# EasyEDA Pro project ProPrj_DiscoTech 6 Current_2026-05-06.epro, board Input_No_Phono
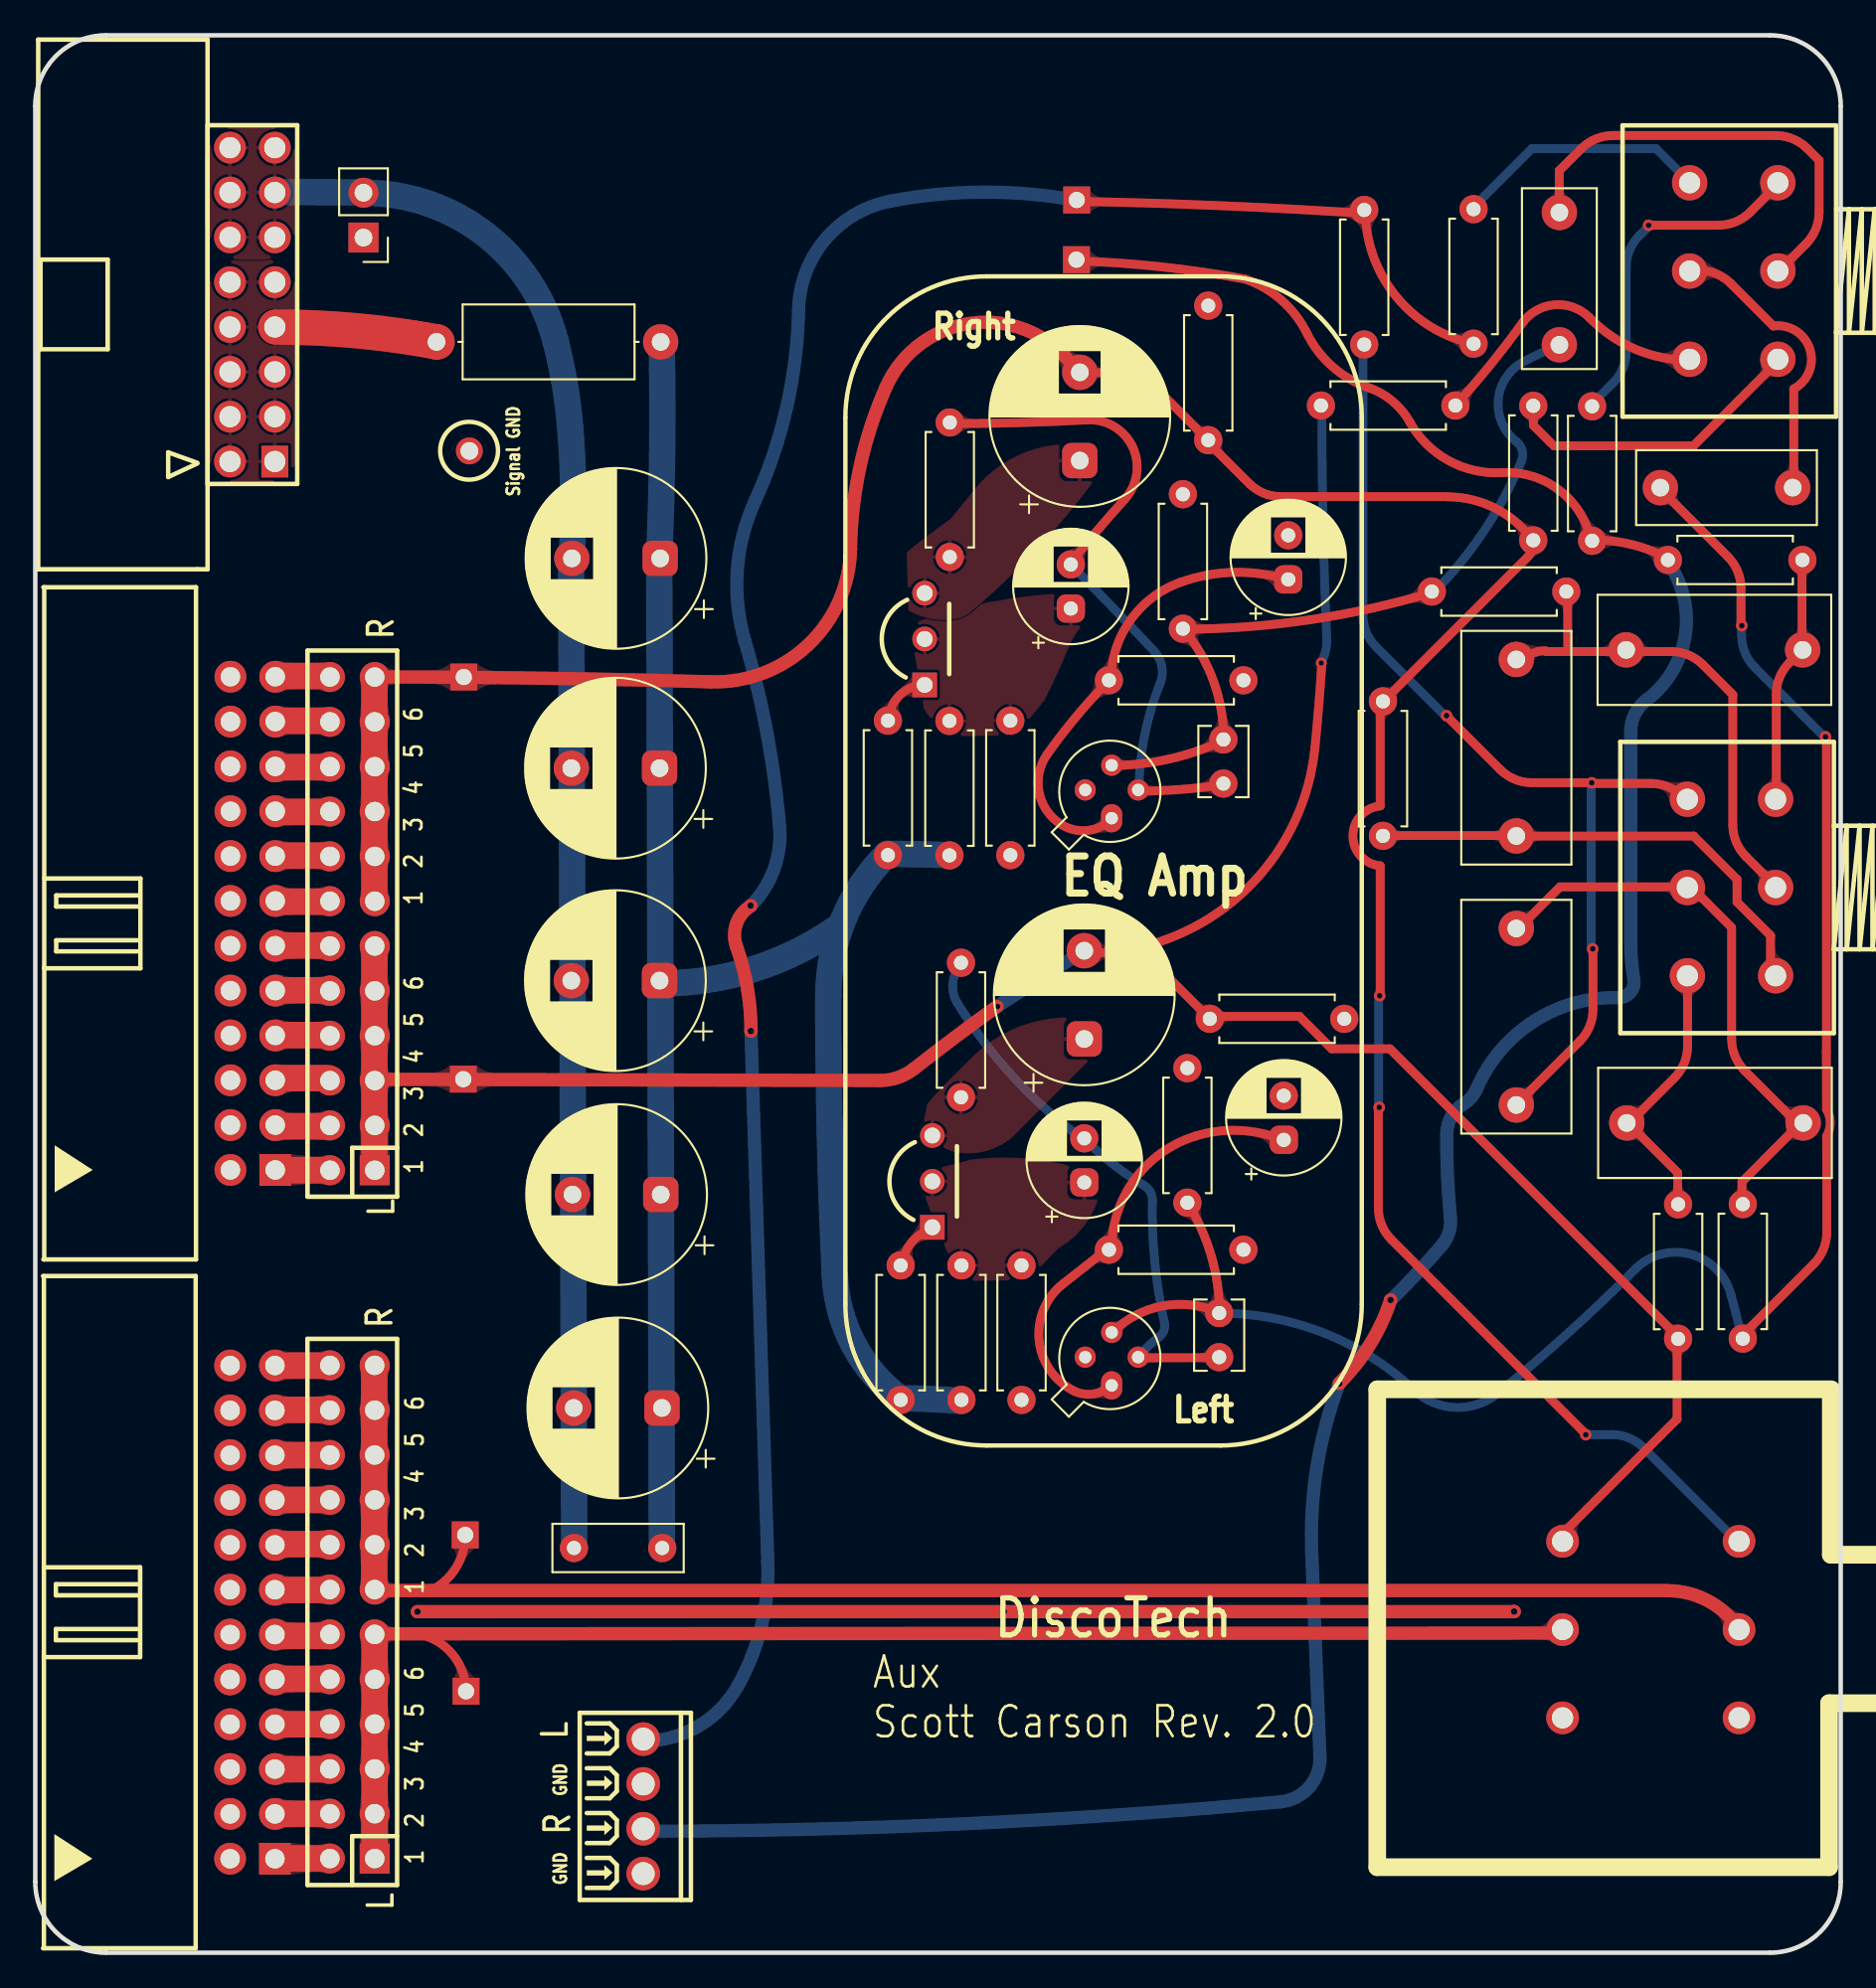
[diagram p22: board, top side]
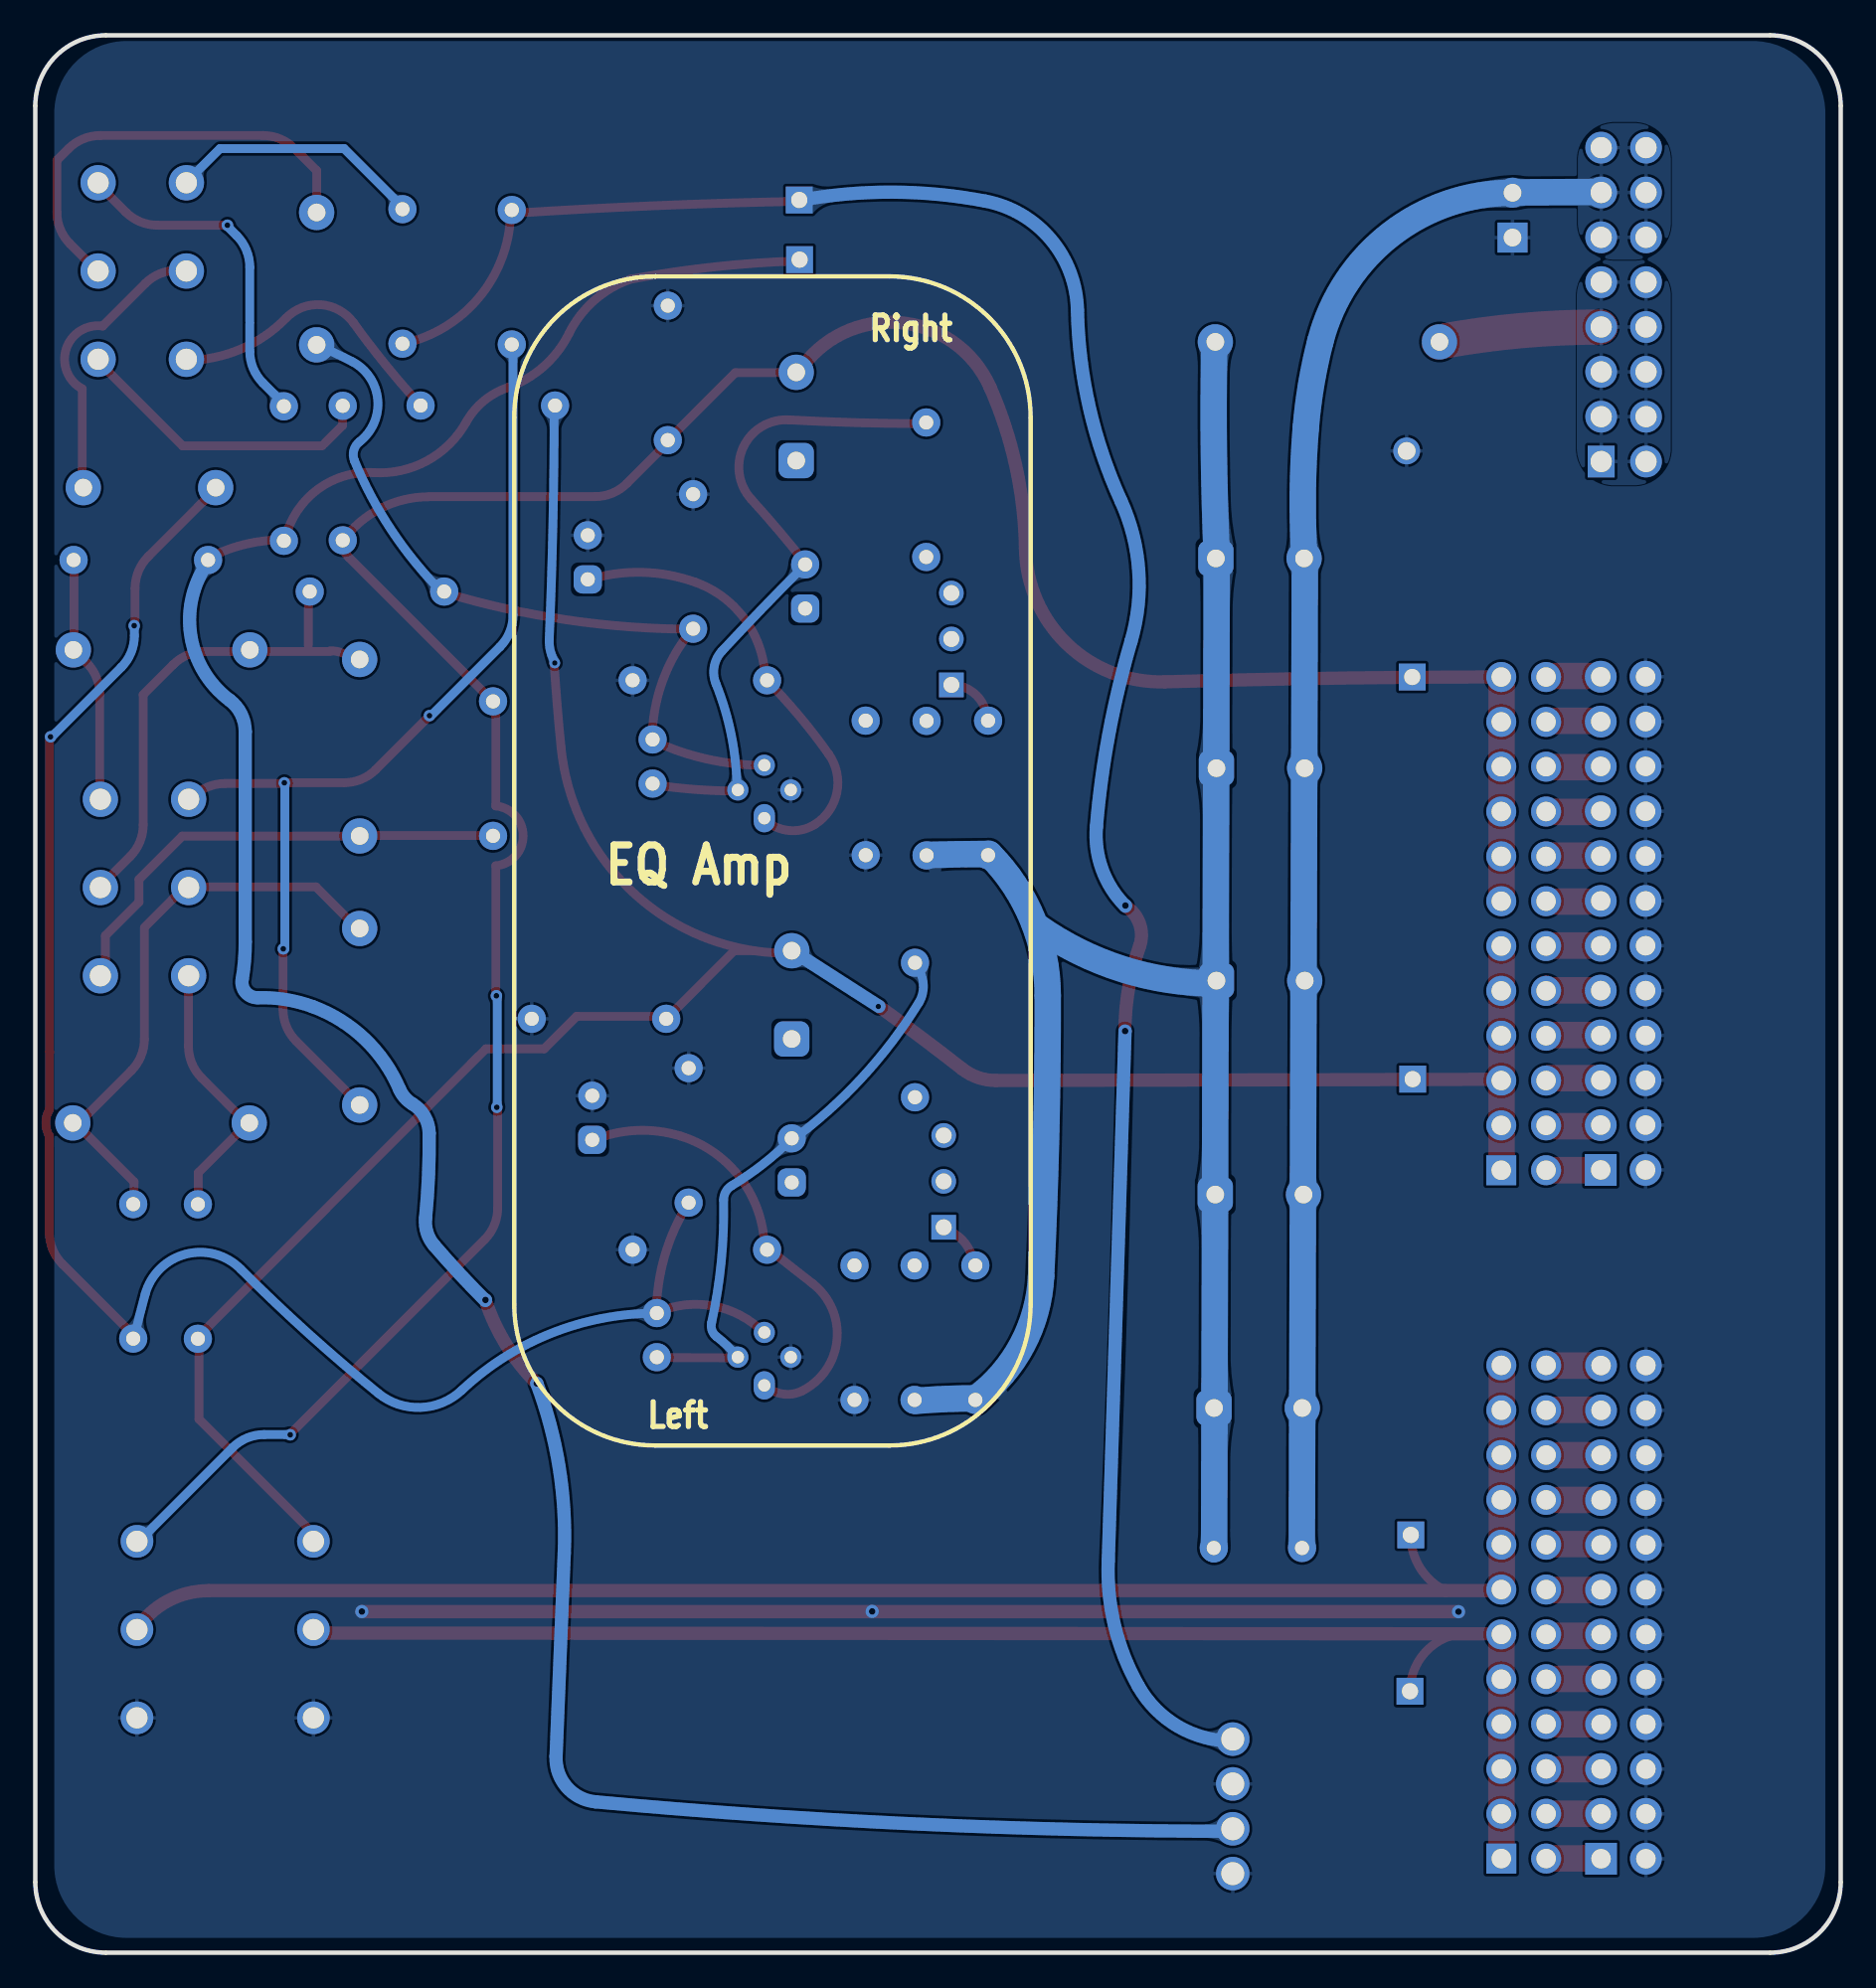
[diagram p23: board, bottom side, seen from below]

Outline 102.3 x 108.62 mm; copper layers: Top Layer, Bottom Layer. Coordinates in mm from the lower left corner of the outline.
Outline path: 0,104.62 0,4 arc(1.17,1.17) 4,0 98.3,0 arc(101.13,1.17) 102.3,4 102.3,104.62 arc(101.13,107.45) 98.3,108.62 4,108.62 arc(1.17,107.45) 0,104.62
Stack: Top Layer 0.035mm / Dielectric1 1.51mm FR4 er 4.5 / Bottom Layer 0.035mm

## Design rules (mm)
template: Custom Config
spacing copperThickness1oz (default): track to track 0.102, other pairs 0.152 to 0.3
spacing copperThickness2oz: track to track 0.203, other pairs 0.152 to 0.3
track width copperThickness1oz (default): min 0.127, default 0.75, max 2.54
track width copperThickness2oz: min 0.203, default 0.254, max 2.54
differential pair differentialPair (default): width min 0.127, default 0.254, max 2.54; gap min 0.152, default 0.152
via viaSize (default): diameter min 0.5, default 0.61, max 10; hole min 0.3, default 0.305, max 6.3

## Placement (name value [footprint] x y rotation side)
C1  47uF  [Capacitor_THT:CP_Radial_D6.3mm_P2.50mm]  70.74 46.05 90 top
C2  47uF  [Capacitor_THT:CP_Radial_D6.3mm_P2.50mm]  70.99 77.8 90 top
C3  100nF  [Capacitor_THT:C_Rect_L7.2mm_W2.5mm_P5.00mm_FKS2_FKP2_MKS2_MKP2]  30.52 22.93 0 top
C5  100uF  [Capacitor_THT:CP_Radial_D10.0mm_P5.00mm]  59.44 51.76 90 top
C6  100uF  [Capacitor_THT:CP_Radial_D10.0mm_P5.00mm]  59.18 84.53 90 top
C7  100uF  [Capacitor_THT:CP_Radial_D10.0mm_P5.00mm]  35.37 67.1 180 top
C8  10pF  [Capacitor_THT:C_Disc_D3.8mm_W2.6mm_P2.50mm]  67.08 36.24 270 top
C9  10pF  [Capacitor_THT:C_Disc_D3.8mm_W2.6mm_P2.50mm]  67.32 68.73 270 top
C10  100uF  [Capacitor_THT:CP_Radial_D10.0mm_P5.00mm]  35.37 55.07 180 top
C11  47uF  [Capacitor_THT:CP_Radial_D6.3mm_P2.50mm]  59.44 43.63 90 top
C12  47uF  [Capacitor_THT:CP_Radial_D6.3mm_P2.50mm]  58.67 76.15 90 top
C13  100uF  [Capacitor_THT:CP_Radial_D10.0mm_P5.00mm]  35.44 42.95 180 top
C14  100uF  [Capacitor_THT:CP_Radial_D10.0mm_P5.00mm]  35.51 30.86 180 top
C15  68nF  [Capacitor_THT:C_Rect_L13.0mm_W6.0mm_P10.00mm_FKS3_FKP3_MKS4]  90.14 73.8 0 top
C16  2.2nF  [Capacitor_THT:C_Rect_L10.0mm_W4.0mm_P7.50mm_FKS3_FKP3]  86.36 91.08 90 top
C17  68nF  [Capacitor_THT:C_Rect_L13.0mm_W6.0mm_P10.00mm_FKS3_FKP3_MKS4]  83.92 63.26 90 top
C18  68nF  [Capacitor_THT:C_Rect_L13.0mm_W6.0mm_P10.00mm_FKS3_FKP3_MKS4]  83.92 48.02 90 top
C19  68nF  [Capacitor_THT:C_Rect_L13.0mm_W6.0mm_P10.00mm_FKS3_FKP3_MKS4]  100.17 47.01 180 top
C20  2.2nF  [Capacitor_THT:C_Rect_L10.0mm_W4.0mm_P7.50mm_FKS3_FKP3]  99.58 83 180 top
C21  100uF  [Capacitor_THT:CP_Radial_D10.0mm_P5.00mm]  35.4 78.99 180 top
FB1  FerriteBead_Small  [Inductor_THT:L_Axial_L9.5mm_D4.0mm_P12.70mm_Horizontal_Fastron_SMCC]  22.73 91.25 0 top
H3  PZ254V-12-24P  [HDR-TH_24P-P2.54-V-M-R2-C12-S2.54]  17.96 19.3 90 top
H4  PZ254V-12-24P  [HDR-TH_24P-P2.54-V-M-R2-C12-S2.54]  17.97 58.3 90 top
J1  -  [2n3822]  60.83 33.73 90 top
J2  -  [2n3822]  60.83 65.86 90 top
JP1  GND Bridge  [Connector_PinHeader_2.54mm:PinHeader_1x02_P2.54mm_Vertical]  18.59 97.16 180 top
NOREF  -  [Pad_e21]  24.41 14.81 0 top
NOREF#2  -  [Pad_e82]  24.28 72.27 0 top
NOREF#3  -  [Pad_e41]  24.36 23.67 0 top
NOREF#4  -  [Pad_e87]  24.25 49.49 0 top
NOREF#5  -  [Pad_e307]  24.59 85.08 270 top
NOREF#6  -  [Pad_e89]  58.99 95.91 0 top
NOREF#7  -  [Pad_e95]  59.01 99.29 0 top
P1  Power  [CONN-TH_16P-P2.54_C9142]  12.3 93.36 270 top
P2  Master  [IDC-TH_24P-P2.54_ZHOURI_DC3-2.54-24PAL]  12.31 19.29 270 top
P3  Cue  [IDC-TH_24P-P2.54_ZHOURI_DC3-2.54-24PAL]  12.33 58.31 270 top
Q1  BC550  [TO-92-3_L4.8-W3.7-P2.60-L_LP0003A]  50.83 43.69 90 top
Q2  BC550  [TO-92-3_L4.8-W3.7-P2.60-L_LP0003A]  50.39 74.42 90 top
R1  470k  [Resistor_THT:R_Axial_DIN0207_L6.3mm_D2.5mm_P7.62mm_Horizontal]  55.88 38.93 270 top
R2  1M  [Resistor_THT:R_Axial_DIN0207_L6.3mm_D2.5mm_P7.62mm_Horizontal]  65.28 42.49 90 top
R3  220R  [Resistor_THT:R_Axial_DIN0207_L6.3mm_D2.5mm_P7.62mm_Horizontal]  60.83 39.82 0 top
R4  100k  [Resistor_THT:R_Axial_DIN0207_L6.3mm_D2.5mm_P7.62mm_Horizontal]  66.55 52.9 0 top
R5  470k  [Resistor_THT:R_Axial_DIN0207_L6.3mm_D2.5mm_P7.62mm_Horizontal]  55.25 69.8 270 top
R6  1M  [Resistor_THT:R_Axial_DIN0207_L6.3mm_D2.5mm_P7.62mm_Horizontal]  65.02 75 90 top
R7  220R  [Resistor_THT:R_Axial_DIN0207_L6.3mm_D2.5mm_P7.62mm_Horizontal]  60.83 72.08 0 top
R8  100k  [Resistor_THT:R_Axial_DIN0207_L6.3mm_D2.5mm_P7.62mm_Horizontal]  66.46 85.69 90 top
R9  470R  [Resistor_THT:R_Axial_DIN0207_L6.3mm_D2.5mm_P7.62mm_Horizontal]  52.45 48.46 90 top
R10  470R  [Resistor_THT:R_Axial_DIN0207_L6.3mm_D2.5mm_P7.62mm_Horizontal]  51.82 79.07 90 top
R11  220k  [Resistor_THT:R_Axial_DIN0207_L6.3mm_D2.5mm_P7.62mm_Horizontal]  52.48 31.31 90 top
R12  330R  [Resistor_THT:R_Axial_DIN0207_L6.3mm_D2.5mm_P7.62mm_Horizontal]  49.03 31.31 90 top
R13  220k  [Resistor_THT:R_Axial_DIN0207_L6.3mm_D2.5mm_P7.62mm_Horizontal]  51.8 62.16 90 top
R14  330R  [Resistor_THT:R_Axial_DIN0207_L6.3mm_D2.5mm_P7.62mm_Horizontal]  48.31 62.18 90 top
R15  Bass 50kΩ  [RES-ADJ-TH_RK16312A0BKH]  96.11 60.34 0 top
R16  Treble 50kΩ  [RES-ADJ-TH_RK16312A0BKH]  96.24 95.27 0 top
R17  6k8  [Resistor_THT:R_Axial_DIN0207_L6.3mm_D2.5mm_P7.62mm_Horizontal]  86.75 77.11 180 top
R18  12k  [Resistor_THT:R_Axial_DIN0207_L6.3mm_D2.5mm_P7.62mm_Horizontal]  76.36 70.89 270 top
R19  3k3  [Resistor_THT:R_Axial_DIN0207_L6.3mm_D2.5mm_P7.62mm_Horizontal]  88.21 79.98 90 top
R20  12k  [Resistor_THT:R_Axial_DIN0207_L6.3mm_D2.5mm_P7.62mm_Horizontal]  93.09 42.4 270 top
R21  12k  [Resistor_THT:R_Axial_DIN0207_L6.3mm_D2.5mm_P7.62mm_Horizontal]  92.51 78.9 0 top
R22  12k  [Resistor_THT:R_Axial_DIN0207_L6.3mm_D2.5mm_P7.62mm_Horizontal]  75.3 91.1 90 top
R23  6k8  [Resistor_THT:R_Axial_DIN0207_L6.3mm_D2.5mm_P7.62mm_Horizontal]  96.75 34.79 90 top
R24  3k3  [Resistor_THT:R_Axial_DIN0207_L6.3mm_D2.5mm_P7.62mm_Horizontal]  84.88 87.63 270 top
R25  3k3  [Resistor_THT:R_Axial_DIN0207_L6.3mm_D2.5mm_P7.62mm_Horizontal]  81.49 91.15 90 top
R26  3k3  [Resistor_THT:R_Axial_DIN0207_L6.3mm_D2.5mm_P7.62mm_Horizontal]  80.47 87.65 180 top
U1  Volume 50kΩ  [RES-ADJ-TH_RK27112A0A16]  91.54 18.3 0 top
U2  In  [CONN-TH_4P-P2.54_MX128-2.54-GN01-04P-CU-Y-A]  34.45 8.29 270 top

## Footprints (pads in the part's own frame, mm; a bottom-side part is the same pattern mirrored in y, then rotated)
2n3822
  oval 1.6x1.2 hole 0.7: 1(-1.589,-0.157)
  round 1.2 hole 0.7: 2(0.011,-1.657) 3(1.411,-0.157) 4(0.011,1.343)
Capacitor_THT:C_Disc_D3.8mm_W2.6mm_P2.50mm
  round 1.6 hole 0.8: 1(0,0) 2(2.5,0)
Capacitor_THT:C_Rect_L7.2mm_W2.5mm_P5.00mm_FKS2_FKP2_MKS2_MKP2
  round 1.6 hole 0.8: 1(0,0) 2(5,0)
Capacitor_THT:C_Rect_L10.0mm_W4.0mm_P7.50mm_FKS3_FKP3
  round 2 hole 1: 1(0,0) 2(7.5,0)
Capacitor_THT:C_Rect_L13.0mm_W6.0mm_P10.00mm_FKS3_FKP3_MKS4
  round 2 hole 1: 1(0,0) 2(10,0)
Capacitor_THT:CP_Radial_D6.3mm_P2.50mm
  rrect 1.6x1.6 hole 0.8: 1(0,0)
  round 1.6 hole 0.8: 2(2.5,0)
Capacitor_THT:CP_Radial_D10.0mm_P5.00mm
  rrect 2x2 hole 1: 1(0,0)
  round 2 hole 1: 2(5,0)
CONN-TH_4P-P2.54_MX128-2.54-GN01-04P-CU-Y-A
  round 1.9 hole 1.3: 1(-3.81,0) 2(-1.27,0) 3(1.27,0) 4(3.81,0)
CONN-TH_16P-P2.54_C9142
  rect 1.8x1.524 hole 1.2: 1(8.89,1.27)
  round 1.8 hole 1.2: 2(8.89,-1.27) 3(6.35,1.27) 4(6.35,-1.27) 5(3.81,1.27) 6(3.81,-1.27) 7(1.27,1.27) 8(1.27,-1.27) 9(-1.27,1.27) 10(-1.27,-1.27) 11(-3.81,1.27) 12(-3.81,-1.27) 13(-6.35,1.27) 14(-6.35,-1.27) 15(-8.89,1.27) 16(-8.89,-1.27)
Connector_PinHeader_2.54mm:PinHeader_1x02_P2.54mm_Vertical
  rect 1.7x1.7 hole 1: 1(0,0)
  round 1.7 hole 1: 2(0,-2.54)
HDR-TH_24P-P2.54-V-M-R2-C12-S2.54
  rect 1.7x1.7 hole 1.1: 1(-13.97,-1.27)
  round 1.7 hole 1.1: 2(-13.97,1.27) 3(-11.43,-1.27) 4(-11.43,1.27) 5(-8.89,-1.27) 6(-8.89,1.27) 7(-6.35,-1.27) 8(-6.35,1.27) 9(-3.81,-1.27) 10(-3.81,1.27) 11(-1.27,-1.27) 12(-1.27,1.27) 13(1.27,-1.27) 14(1.27,1.27) 15(3.81,-1.27) 16(3.81,1.27) 17(6.35,-1.27) 18(6.35,1.27) 19(8.89,-1.27) 20(8.89,1.27) 21(11.43,-1.27) 22(11.43,1.27) 23(13.97,-1.27) 24(13.97,1.27)
IDC-TH_24P-P2.54_ZHOURI_DC3-2.54-24PAL
  rect 1.8x1.8 hole 1.1: 1(13.97,1.27)
  round 1.8 hole 1.1: 2(13.97,-1.27) 3(11.43,1.27) 4(11.43,-1.27) 5(8.89,1.27) 6(8.89,-1.27) 7(6.35,1.27) 8(6.35,-1.27) 9(3.81,1.27) 10(3.81,-1.27) 11(1.27,1.27) 12(1.27,-1.27) 13(-1.27,1.27) 14(-1.27,-1.27) 15(-3.81,1.27) 16(-3.81,-1.27) 17(-6.35,1.27) 18(-6.35,-1.27) 19(-8.89,1.27) 20(-8.89,-1.27) 21(-11.43,1.27) 22(-11.43,-1.27) 23(-13.97,1.27) 24(-13.97,-1.27)
Inductor_THT:L_Axial_L9.5mm_D4.0mm_P12.70mm_Horizontal_Fastron_SMCC
  round 2 hole 1: 1(0,0) 2(12.7,0)
Pad_e21
  rect 1.524x1.524 hole 0.914: 1(0,0)
Pad_e41
  rect 1.524x1.524 hole 0.914: 1(0,0)
Pad_e82
  rect 1.524x1.524 hole 0.914: 2(0,0)
Pad_e87
  rect 1.524x1.524 hole 0.914: 3(0,0)
Pad_e89
  rect 1.524x1.524 hole 0.914: 4(0,0)
Pad_e95
  rect 1.524x1.524 hole 0.914: 5(0,0)
Pad_e307
  round 1.524 hole 1: 1(0,0)
RES-ADJ-TH_RK16312A0BKH
  round 2 hole 1.2: 1(2.5,-5) 2(2.5,0) 3(2.5,5) 4(-2.5,-5) 5(-2.5,0) 6(-2.5,5)
RES-ADJ-TH_RK27112A0A16
  round 1.85 hole 1.2: 1(-5,5) 2(-5,0) 3(-5,-5) 4(5,-5) 5(5,0) 6(5,5)
Resistor_THT:R_Axial_DIN0207_L6.3mm_D2.5mm_P7.62mm_Horizontal
  round 1.6 hole 0.8: 1(0,0) 2(7.62,0)
TO-92-3_L4.8-W3.7-P2.60-L_LP0003A
  rect 1.4x1.4 hole 0.9: 1(-2.6,0)
  round 1.4 hole 0.9: 2(0,0) 3(2.6,0)

## Nets
As in the schematic, except:
GNDS: C1.2 C2.2 J1.4 J2.4 JP1.1 NOREF#5.1 P2.2 P2.4 P2.6 P2.8 P2.10 P2.12 P2.14 P2.16 P2.18 P2.20 P2.22 P2.24 P3.2 P3.4 P3.6 P3.8 P3.10 P3.12 P3.14 P3.16 P3.18 P3.20 P3.22 P3.24 R1.2 R2.2 R3.2 R4.2 R5.2 R6.2 R7.2 R8.2 U1.3 U1.4 U2.2 U2.4
LCUE: C5.2 H4.1 H4.3 H4.5 H4.7 H4.9 H4.11 NOREF#4.3 R4.1 R20.2 R26.2 U1.1
LEFT: NOREF#7.5 R22.2 R25.1 U2.1
LOUT: H3.1 H3.3 H3.5 H3.7 H3.9 H3.11 NOREF.1 U1.2
RCUE: C6.2 H4.13 H4.15 H4.17 H4.19 H4.21 H4.23 NOREF#2.2 R8.1 R18.1 R24.2 U1.6
RIGHT: NOREF#6.4 R19.1 R21.1 U2.3
ROUT: H3.13 H3.15 H3.17 H3.19 H3.21 H3.23 NOREF#3.1 U1.5

## Via types
v1: diameter 0.65, hole 0.325, Top Layer to Bottom Layer, 9 vias
v2: diameter 0.75, hole 0.375, Top Layer to Bottom Layer, 7 vias
v3: diameter 0.61, hole 0.305, Top Layer to Bottom Layer, 2 vias

## Routing (per net, layer and track width the routed paths; a pad name or vN(x,y) marks a point on that pad's centre or on a via; arc(x,y) is an arc through that point)
40V: length 9.2
  Top Layer w2: 13.62,92.09 arc(18.22,91.88) 22.77,91.25
GNDREF: length 88.2
  Bottom Layer w1.5: 30.36,78.99 30.51,30.86 30.53,22.93 ; 18.55,99.72 13.57,99.75 ; 18.62,99.7 arc(25.49,97.35) 29.48,91.28 arc(30,88.86) 30.31,86.4 arc(30.48,82.71) 30.39,79.02
GNDS: length 62.1
  Top Layer w0.75: v2(21.66,19.32) 83.79,19.32 83.8,19.33
  vias: v2(54.88,19.33) v2(83.79,19.33)
LCUE: length 148.3
  Top Layer w0.5: 93.19,34.78 76.76,51.2 73.46,51.2 71.62,53.04 66.93,53.04 ; 61.57,56.76 62.69,56.76 R4.1 ; 61.57,56.76 arc(60.61,56.65) 59.64,56.62 ; 61.57,56.76 arc(69.01,60.64) 72.51,68.26 arc(72.73,70.67) 72.9,73.09 ; 86.28,23.49 93.02,30.23 93.02,34.9
  Top Layer w0.75: 19.11,49.48 19.21,49.48 47.86,49.41 arc(48.87,49.58) 49.78,50.07 arc(52.12,51.86) 54.49,53.6
  Top Layer w1.5: 19.21,57.03 19.21,44.31
  Bottom Layer w0.5: 72.83,73.07 arc(73.1,73.7) 73.18,74.39 arc(72.97,80.97) 72.9,87.54
  Bottom Layer w0.75: 54.5,53.61 59.42,56.77
  vias: v3(54.53,53.6) v3(72.87,73.06)
LEFT: length 132.6
  Top Layer w0.5: 75.36,98.53 arc(77.15,93.78) 81.48,91.14 ; 75.36,98.53 arc(75.36,98.61) 75.36,98.7 ; 75.36,98.53 arc(67.19,98.97) 59.01,99.21 ; 75.36,98.53 arc(75.38,98.52) 75.39,98.52
  Top Layer w0.75: 40.56,52.2 arc(40.35,54.64) 39.73,57.01 arc(39.73,58.29) 40.54,59.29
  Bottom Layer w0.75: 34.48,11.99 arc(37.55,12.82) 39.79,15.09 arc(41.15,18.53) 41.5,22.21 arc(40.94,37.19) 40.55,52.18 ; 40.53,59.29 arc(41.85,61.36) 42.17,63.78 arc(41.46,69.09) 40.21,74.29 arc(39.78,78.32) 40.78,82.24 arc(42.57,87.52) 43.25,93.05 arc(44.76,97.06) 48.46,99.23 arc(53.75,99.74) 59.04,99.26
  vias: v2(40.53,59.32) v2(40.55,52.21)
LOUT: length 85
  Top Layer w0.5: 86.68,18.41 86.39,18.7 ; 24.41,14.78 arc(23.62,16.93) 21.64,18.06
  Top Layer w0.75: 19.18,5.45 19.22,5.45 ; 86.55,18.11 19.24,18.06
  Top Layer w1.5: 19.22,5.45 19.22,18.04
RCUE: length 167.4
  Top Layer w0.5: 87.88,29.35 76.84,40.39 arc(76.29,41.22) 76.1,42.19 76.1,47.88 ; 66.38,85.63 68.78,83.23 arc(69.6,82.68) 70.58,82.49 80,82.49 ; 76.44,70.95 84.55,79.06 arc(84.84,79.5) 84.95,80.02 ; 66.36,85.78 62.63,89.51 59.12,89.51 ; 76.21,70.85 76.21,64.96 arc(74.66,63.27) 76.21,61.57 76.21,54.27 arc(76.2,54.23) 76.18,54.19 ; 80.01,82.48 arc(82.74,81.82) 84.87,79.98
  Top Layer w0.75: 59.01,89.59 arc(53.34,92.34) 48.2,88.69 arc(46.74,84.22) 46.19,79.54 arc(43.82,74.12) 38.3,71.99 arc(31.29,72.16) 24.28,72.25 arc(21.75,72.26) 19.21,72.27 arc(19.19,72.27) 19.17,72.27
  Top Layer w1.5: 19.21,59.57 19.21,72.27
  Bottom Layer w0.5: 96.48,23.25 91.12,28.61 arc(90.3,29.16) 89.33,29.35 87.86,29.35 ; 76.12,54.17 76.12,47.89
  vias: v1(76.17,54.21) v1(76.15,47.89) v1(87.85,29.34)
RIGHT: length 157.6
  Top Layer w0.5: 68.54,94.81 arc(63.78,95.51) 58.99,95.84 ; 88.19,79.81 arc(86.42,82.8) 83.11,83.84 arc(80.08,84.52) 77.89,86.7 arc(76.9,87.89) 75.55,88.65 arc(73.5,89.85) 72.06,91.73 arc(70.61,93.61) 68.56,94.81 ; 88.32,80.03 arc(90.55,79.75) 92.65,78.91
  Top Layer w0.75: 73.89,32.26 arc(75.61,34.44) 76.79,36.94
  Bottom Layer w0.75: 34.42,6.88 arc(52.51,7.3) 70.55,8.55 arc(72.19,9.38) 72.79,11.12 72.33,22.64 arc(72.62,27.51) 73.87,32.23 ; 76.8,36.95 arc(78.28,38.48) 79.7,40.07 arc(80.1,40.79) 80.19,41.61 arc(80.02,44.01) 79.98,46.42 arc(80.24,47.38) 80.94,48.09 arc(81.36,48.45) 81.66,48.92 arc(83.63,51.76) 86.57,53.59 arc(88.1,53.99) 89.68,54.1 arc(90.37,54.4) 90.58,55.13 arc(90.44,56.19) 90.4,57.26 90.4,69.18 arc(90.64,70.17) 91.29,70.96 arc(93.5,74.68) 92.43,78.88
  vias: v2(73.88,32.25) v2(76.79,36.98)
ROUT: length 94.5
  Top Layer w0.5: 24.36,23.65 arc(23.83,21.8) 22.41,20.51
  Top Layer w0.75: 92.46,20.51 19.27,20.51 ; 92.49,20.51 arc(94.81,19.92) 96.56,18.31
  Top Layer w1.5: 19.2,33.26 19.2,20.61
VDC: length 118.1
  Top Layer w1.5: 35.23,55.16 arc(35.32,55.16) 35.42,55.16
  Bottom Layer w1.5: 35.42,55.16 35.45,43.26 ; 35.42,55.16 35.36,79.02 ; 35.42,55.16 arc(35.32,55.16) 35.23,55.16 ; 35.5,22.86 35.45,42.87 arc(35.43,42.87) 35.41,42.87 ; 48.27,62.25 arc(48.24,62.23) 48.21,62.2 arc(45.79,58.53) 44.93,54.22 arc(45.02,46.26) 45.31,38.31 arc(46.37,34.45) 48.97,31.4 arc(50.69,31.37) 52.4,31.26 ; 35.5,90.69 arc(35.52,84.98) 35.36,79.28 ; 48.36,62.24 arc(50.09,62.23) 51.82,62.18 ; 35.44,54.91 arc(40.72,55.73) 45.5,58.1
$1N449: length 104.1
  Top Layer w0.5: 101.49,51.02 101.49,47.77 arc(101.7,47.01) 101.5,46.25 101.51,43.26 ; 101.49,51.02 101.49,68.68 arc(101.47,68.77) 101.42,68.84 ; 96.63,34.88 100.76,39.01 arc(101.31,39.84) 101.51,40.81 101.51,43.2 ; 92.02,82.97 95.9,79.09 arc(96.45,78.26) 96.65,77.29 96.65,75.11 ; 67.1,36.17 arc(66.64,39.47) 65.27,42.5 ; 61.03,35.14 arc(63.86,36.63) 67.04,36.28
  Bottom Layer w0.5: 101.4,68.85 97.43,72.82 arc(96.88,73.64) 96.68,74.61 96.68,75.13 ; 67.11,36.23 arc(73.04,35.1) 78.14,31.86 arc(80.47,30.89) 82.87,31.69 arc(86.86,35.11) 90.66,38.73 arc(93.78,39.57) 96.07,37.3 arc(96.42,36.01) 96.73,34.71
  vias: v1(96.7,75.18) v1(101.44,68.88)
$1N454: length 32.4
  Top Layer w0.5: 62.5,33.7 67.09,33.72
  Bottom Layer w0.5: 59.42,46.03 arc(55.46,49.57) 52.24,53.81 arc(51.99,54.95) 52.5,56 ; 59.45,46.1 arc(61.07,44.67) 62.84,43.45 arc(63.18,43.1) 63.3,42.62 arc(63.43,39.13) 63.98,35.67 arc(63.95,35.24) 63.7,34.9 arc(63.09,34.38) 62.56,33.79
$1N476: length 26.4
  Top Layer w0.5: 60.75,39.86 58.24,37.9 arc(56.88,34.7) 58.84,31.83 arc(59.97,31.65) 60.98,32.17 ; 70.65,46.05 arc(68.21,46.58) 65.74,46.26 arc(62.3,43.82) 60.98,39.81
$1N480: length 3.1
  Top Layer w0.5: 49.13,38.79 arc(49.62,40.2) 50.88,41.01
$1N855: length 45.7
  Top Layer w0.5: 67.34,68.71 arc(66.76,72.04) 65.06,74.97 ; 65.01,74.98 arc(72.17,75.5) 79.18,77.07 ; 61.01,67.26 arc(64.29,67.63) 67.39,68.71
  Bottom Layer w0.5: 79.2,77.02 arc(82.07,80.52) 84.21,84.51 arc(84.25,85.1) 83.93,85.6 arc(82.89,87.97) 84.33,90.13 arc(85.33,90.62) 86.35,91.07
$1N860: length 38.6
  Top Layer w0.5: 51.82,86.62 arc(55.71,86.67) 59.6,86.83 arc(62.17,85.31) 61.74,82.35 arc(60.17,80.56) 58.66,78.71 ; 62.55,65.81 arc(64.95,65.9) 67.34,66.18
  Bottom Layer w0.5: 62.54,65.83 arc(62.85,68.92) 63.73,71.89 arc(63.83,72.86) 63.39,73.74 arc(61.08,76.18) 58.72,78.58
$1N882: length 26.8
  Top Layer w0.5: 60.9,72.13 arc(59.03,70.08) 57.34,67.89 arc(56.88,65.74) 58.11,63.93 arc(59.62,63.57) 61.01,64.24 ; 60.95,72.03 arc(62.03,75.45) 64.88,77.63 arc(67.94,78.2) 71.03,77.76
$1N886: length 3.2
  Top Layer w0.5: 48.37,69.78 arc(48.96,71.22) 50.39,71.82
$1N6655: length 57.9
  Top Layer w0.5: 83.88,48 87.52,51.64 arc(88.07,52.47) 88.26,53.44 88.26,56.9 ; 93.47,65.36 93.34,65.49 arc(92.52,66.04) 91.54,66.24 88.12,66.24 ; 79.95,70.08 83,67.02 arc(83.83,66.47) 84.8,66.28 87.89,66.28
  Bottom Layer w0.5: 79.85,70.09 75.97,73.98 arc(75.42,74.8) 75.23,75.77 75.23,91.08 ; 88.16,56.84 88.16,66.29
  vias: v1(79.96,70.08) v1(88.19,66.27) v1(88.25,56.87)
$1N6656: length 15.5
  Top Layer w0.5: 93.06,42.51 93.06,44.18 90.16,47.08 ; 93.62,55.38 93.62,51.36 arc(93.43,50.38) 92.88,49.56 90.29,46.97
$1N6657: length 32.5
  Top Layer w0.5: 96.12,58.03 96.12,51.76 arc(96.31,50.78) 96.86,49.96 99.89,46.94 ; 100.15,47.12 96.7,43.67 96.7,42.48 ; 96.11,58.09 94.5,59.7 arc(94.02,60.12) 93.5,60.48 ; 93.5,60.38 86.39,60.38 84.07,58.06
$1N6659: length 14.1
  Top Layer w0.5: 100.08,73.77 99.39,73.08 arc(98.84,72.26) 98.65,71.29 98.65,65.45 ; 100.1,73.79 100.17,73.86 ; 100.1,73.79 100.1,73.75 ; 100.1,73.79 100.1,78.92 100.15,78.97
$1N6660: length 27.4
  Top Layer w0.5: 76.43,63.29 83.91,63.29 ; 98.61,55.32 98.6,55.33 98.33,55.6 98.33,57.61 96.42,59.52 96.42,60.8 93.97,63.25 84,63.25 ; 84.03,63.37 84.08,63.32
$1N6661: length 27.9
  Top Layer w0.5: 85.58,73.71 92.69,73.71 arc(93.66,73.52) 94.49,72.97 96.19,71.26 ; 86.83,77.25 86.83,74.06 ; 96.18,71.25 96.18,63.89 arc(96.38,62.92) 96.93,62.1 98.58,60.45 ; 84.23,73.2 arc(84.85,73.61) 85.58,73.75
$1N6663: length 25.8
  Top Layer w0.5: 98.68,95.16 100.33,96.81 arc(100.88,97.63) 101.07,98.6 101.07,101.54 100.41,102.2 arc(99.59,102.75) 98.61,102.94 89.4,102.94 arc(88.42,102.75) 87.6,102.2 86.36,100.96 arc(86.35,100.95) 86.35,100.94 86.35,98.28
$1N6664: length 16.8
  Top Layer w0.5: 93.68,95.3 94.27,95.3 arc(95.25,95.11) 96.07,94.56 98.48,92.15 arc(100.55,90.86) 99.64,88.59 99.64,83.09
$1N6665: length 19.4
  Top Layer w0.5: 98.84,100.27 97.17,98.61 arc(96.35,98.06) 95.38,97.86 95.37,97.86 v1(91.41,97.86)
  Bottom Layer w0.5: 88.23,87.76 89.4,88.93 arc(89.95,89.75) 90.15,90.73 90.15,92.27 ; 90.15,92.41 90.15,95.48 arc(90.34,96.45) 90.89,97.27 91.49,97.87
$1N6666: length 17.2
  Top Layer w0.5: 86.05,85.36 93.95,85.36 98.8,90.22 ; 85.9,85.5 84.89,86.52 84.89,87.53
$1N6667: length 16.7
  Top Layer w0.5: 93.74,90.21 arc(90.67,90.83) 88.08,92.6 arc(86.11,93.36) 84.26,92.32 arc(82.43,89.94) 80.47,87.66
$1N6668: length 14.4
  Bottom Layer w0.5: 81.54,98.94 84.8,102.2 91.83,102.2 93.79,100.25
$1N19497: length 3.1
  Top Layer w1.5: 13.53,33.26 16.63,33.26 16.66,33.29
$1N19499: length 3.1
  Top Layer w1.5: 16.63,30.75 13.59,30.75 13.56,30.72
$1N19501: length 3.1
  Top Layer w1.5: 13.53,28.22 13.56,28.19 16.66,28.19
$1N19503: length 3.1
  Top Layer w1.5: 16.66,25.65 13.56,25.65 13.53,25.68
$1N19505: length 3
  Top Layer w1.5: 16.63,23.15 13.69,23.15 13.62,23.08
$1N19507: length 3.1
  Top Layer w1.5: 16.66,20.55 13.56,20.55 13.53,20.52
$1N19509: length 3.2
  Top Layer w1.5: 13.47,18.07 13.59,17.95 16.57,17.95
$1N19511: length 3.1
  Top Layer w1.5: 13.56,15.51 16.53,15.51 16.6,15.57
$1N19513: length 3.1
  Top Layer w1.5: 13.56,12.97 13.59,12.94 16.66,12.94
$1N19515: length 3.1
  Top Layer w1.5: 16.67,10.39 13.56,10.39
$1N19517: length 3.1
  Top Layer w1.5: 16.69,7.87 13.56,7.87
$1N19519: length 3.1
  Top Layer w1.5: 13.56,5.38 13.6,5.34 16.67,5.34
$1N19633: length 3.1
  Top Layer w1.5: 13.45,72.29 13.48,72.32 16.55,72.32
$1N19635: length 3.1
  Top Layer w1.5: 16.58,69.79 13.48,69.79
$1N19637: length 3.1
  Top Layer w1.5: 16.61,67.16 13.61,67.16 13.51,67.06
$1N19639: length 3.1
  Top Layer w1.5: 13.58,64.69 13.64,64.62 16.67,64.62
$1N19641: length 3.1
  Top Layer w1.5: 13.54,62.05 13.64,62.15 16.61,62.15
$1N19643: length 3.1
  Top Layer w1.5: 16.69,59.54 13.64,59.54 13.59,59.59
$1N19645: length 3.1
  Top Layer w1.5: 16.69,57.05 13.59,57.05
$1N19647: length 3.1
  Top Layer w1.5: 16.69,54.61 16.6,54.52 13.59,54.52
$1N19649: length 3.1
  Top Layer w1.5: 13.54,51.98 16.55,51.98 16.6,52.03
$1N19651: length 3.1
  Top Layer w1.5: 13.54,49.45 13.64,49.54 16.6,49.54
$1N19653: length 3.1
  Top Layer w1.5: 16.64,46.91 16.55,46.82 13.59,46.82
$1N19655: length 3
  Top Layer w1.5: 16.64,44.33 13.64,44.33

## Copper pours and planes (outline as drawn; the poured copper is in the pictures)
40V on Top Layer: 9.72,93.85 9.74,94.13 9.81,94.41 9.91,94.68 10.04,94.93 10.21,95.16 10.41,95.36 10.64,95.53 10.89,95.67 11.16,95.77 11.44,95.83 11.72,95.85 12.85,95.85 13.14,95.83 13.41,95.77 13.68,95.67 13.93,95.53 14.16,95.36 14.36,95.16 14.53,94.93 14.67,94.68 14.77,94.41 14.83,94.13 14.85,93.85 14.85,85.23 14.83,84.94 14.77,84.66 14.67,84.4 14.53,84.14 14.36,83.92 14.16,83.71 13.93,83.54 13.68,83.41 13.41,83.31 13.14,83.25 12.85,83.23 11.72,83.23 11.44,83.25 11.16,83.31 10.89,83.41 10.64,83.54 10.41,83.71 10.21,83.92 10.04,84.14 9.91,84.4 9.81,84.66 9.74,84.94 9.72,85.23
40V on Bottom Layer: 9.72,93.85 9.74,94.13 9.81,94.41 9.91,94.68 10.04,94.93 10.21,95.16 10.41,95.36 10.64,95.53 10.89,95.67 11.16,95.77 11.44,95.83 11.72,95.85 12.85,95.85 13.14,95.83 13.41,95.77 13.68,95.67 13.93,95.53 14.16,95.36 14.36,95.16 14.53,94.93 14.67,94.68 14.77,94.41 14.83,94.13 14.85,93.85 14.85,85.23 14.83,84.94 14.77,84.66 14.67,84.4 14.53,84.14 14.36,83.92 14.16,83.71 13.93,83.54 13.68,83.41 13.41,83.31 13.14,83.25 12.85,83.23 11.72,83.23 11.44,83.25 11.16,83.31 10.89,83.41 10.64,83.54 10.41,83.71 10.21,83.92 10.04,84.14 9.91,84.4 9.81,84.66 9.74,84.94 9.72,85.23
GNDREF on Top Layer: 9.72,101.55 9.74,101.84 9.8,102.11 9.9,102.38 10.04,102.63 10.21,102.86 10.41,103.06 10.64,103.23 10.89,103.37 11.16,103.47 11.44,103.53 11.72,103.55 12.79,103.55 13.08,103.53 13.36,103.47 13.62,103.37 13.87,103.23 14.1,103.06 14.3,102.86 14.48,102.63 14.61,102.38 14.71,102.11 14.77,101.84 14.79,101.55 14.79,98.01 14.77,97.72 14.71,97.44 14.61,97.18 14.48,96.93 14.3,96.7 14.1,96.5 13.87,96.32 13.62,96.19 13.36,96.09 13.08,96.03 12.79,96.01 11.72,96.01 11.44,96.03 11.16,96.09 10.89,96.19 10.64,96.32 10.41,96.5 10.21,96.7 10.04,96.93 9.9,97.18 9.8,97.44 9.74,97.72 9.72,98.01
GNDREF on Bottom Layer: 9.72,101.55 9.74,101.84 9.8,102.11 9.9,102.38 10.04,102.63 10.21,102.86 10.41,103.06 10.64,103.23 10.89,103.37 11.16,103.47 11.44,103.53 11.72,103.55 12.79,103.55 13.08,103.53 13.36,103.47 13.62,103.37 13.87,103.23 14.1,103.06 14.3,102.86 14.48,102.63 14.61,102.38 14.71,102.11 14.77,101.84 14.79,101.55 14.79,98.01 14.77,97.72 14.71,97.44 14.61,97.18 14.48,96.93 14.3,96.7 14.1,96.5 13.87,96.32 13.62,96.19 13.36,96.09 13.08,96.03 12.79,96.01 11.72,96.01 11.44,96.03 11.16,96.09 10.89,96.19 10.64,96.32 10.41,96.5 10.21,96.7 10.04,96.93 9.9,97.18 9.8,97.44 9.74,97.72 9.72,98.01
GNDS on Bottom Layer: 0.97,104.2 0.99,104.54 1.04,104.94 1.14,105.33 1.27,105.7 1.44,106.06 1.64,106.41 1.88,106.73 2.14,107.02 2.44,107.29 2.76,107.53 3.1,107.73 3.46,107.9 3.84,108.03 4.23,108.13 4.62,108.18 4.97,108.2 97.12,108.2 97.47,108.18 97.86,108.13 98.25,108.03 98.63,107.9 98.99,107.73 99.33,107.53 99.65,107.29 99.95,107.02 100.22,106.73 100.45,106.41 100.66,106.06 100.83,105.7 100.96,105.33 101.05,104.94 101.11,104.54 101.12,104.2 101.12,4.94 101.11,4.59 101.05,4.19 100.96,3.81 100.83,3.43 100.66,3.07 100.45,2.73 100.22,2.41 99.95,2.11 99.65,1.84 99.33,1.61 98.99,1.4 98.63,1.23 98.25,1.1 97.86,1.01 97.47,0.95 97.12,0.94 4.97,0.94 4.62,0.95 4.23,1.01 3.84,1.1 3.46,1.23 3.1,1.4 2.76,1.61 2.44,1.84 2.14,2.11 1.88,2.41 1.64,2.73 1.44,3.07 1.27,3.43 1.14,3.81 1.04,4.19 0.99,4.59 0.97,4.94
$1N461 on Top Layer: 52.52,45.4 54.07,45.58 55.4,46.38 60.26,51.24 58.67,52.83 58.62,52.87 58.55,52.88 55.62,52.3 53.13,50.63 51.86,49.36 51.23,48.71 50.64,48.03 50.23,46.15 51.13,45.84 52.02,45.48
$1N470 on Top Layer: 53.06,44.83 56.14,44.89 59.17,44.31 59.58,44.31 59.95,44.14 60.18,43.81 60.17,43.42 60.21,43.04 59.38,41.29 57.92,40 56.19,38.2 52.48,38.16 51.2,41.07 50.08,44.05
$1N867 on Top Layer: 52.8,75.91 56.69,79.6 60.11,83.72 60.13,83.72 58.54,85.31 58.49,85.35 58.42,85.36 55.68,84.71 53.44,83 51.94,81.16 50.69,80.24 49.48,79.29 49.57,76.1 50.93,75.64 52.37,75.7
$1N876 on Top Layer: 57.85,72.58 57.11,71.03 55.53,69.06 51.75,69.01 51.04,69.71 50.45,70.51 49.65,75.17 53.78,76.35 58.04,76.9 59.31,76.8 59.45,76.15 59.42,75.48 58.98,74.92 58.74,74.56 58.54,74.16

Small or netless copper shapes (teardrops, artwork), in the pictures only: 204 on Top Layer, 66 on Bottom Layer

## Text on the board
Bottom Silkscreen Layer: Right | Left | EQ Amp
Top Silkscreen Layer: GND | Signal GND | 1  2  3  4  5  6 | R | L | Right | Left | Aux / Scott Carson Rev. 2.0 | DiscoTech | EQ Amp
